# EAGLE board E-P-206-R2.0.1 Fuel Cell Control (EAGLE 7.7.0)
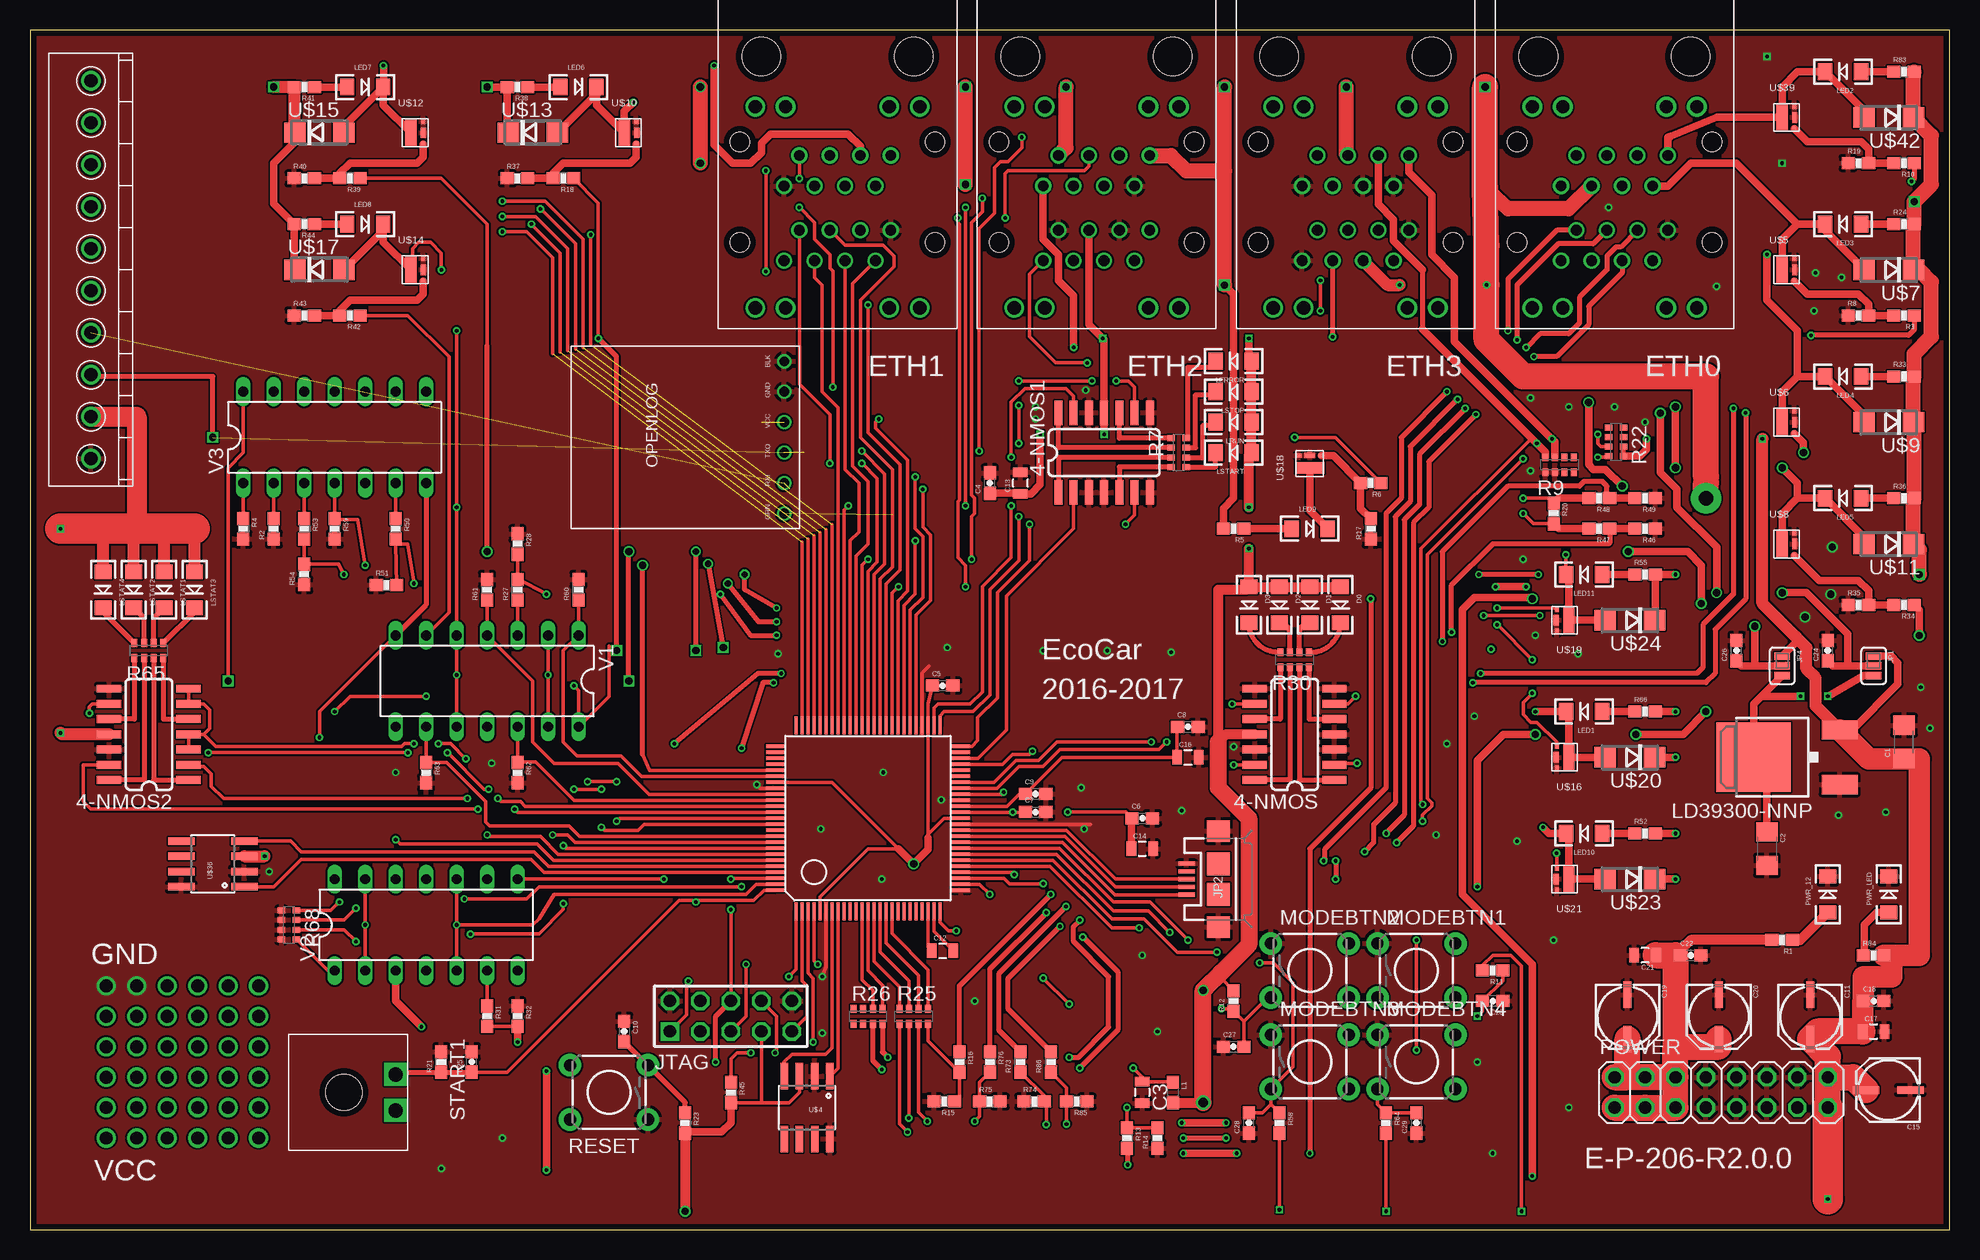
[diagram p5: board, top side]
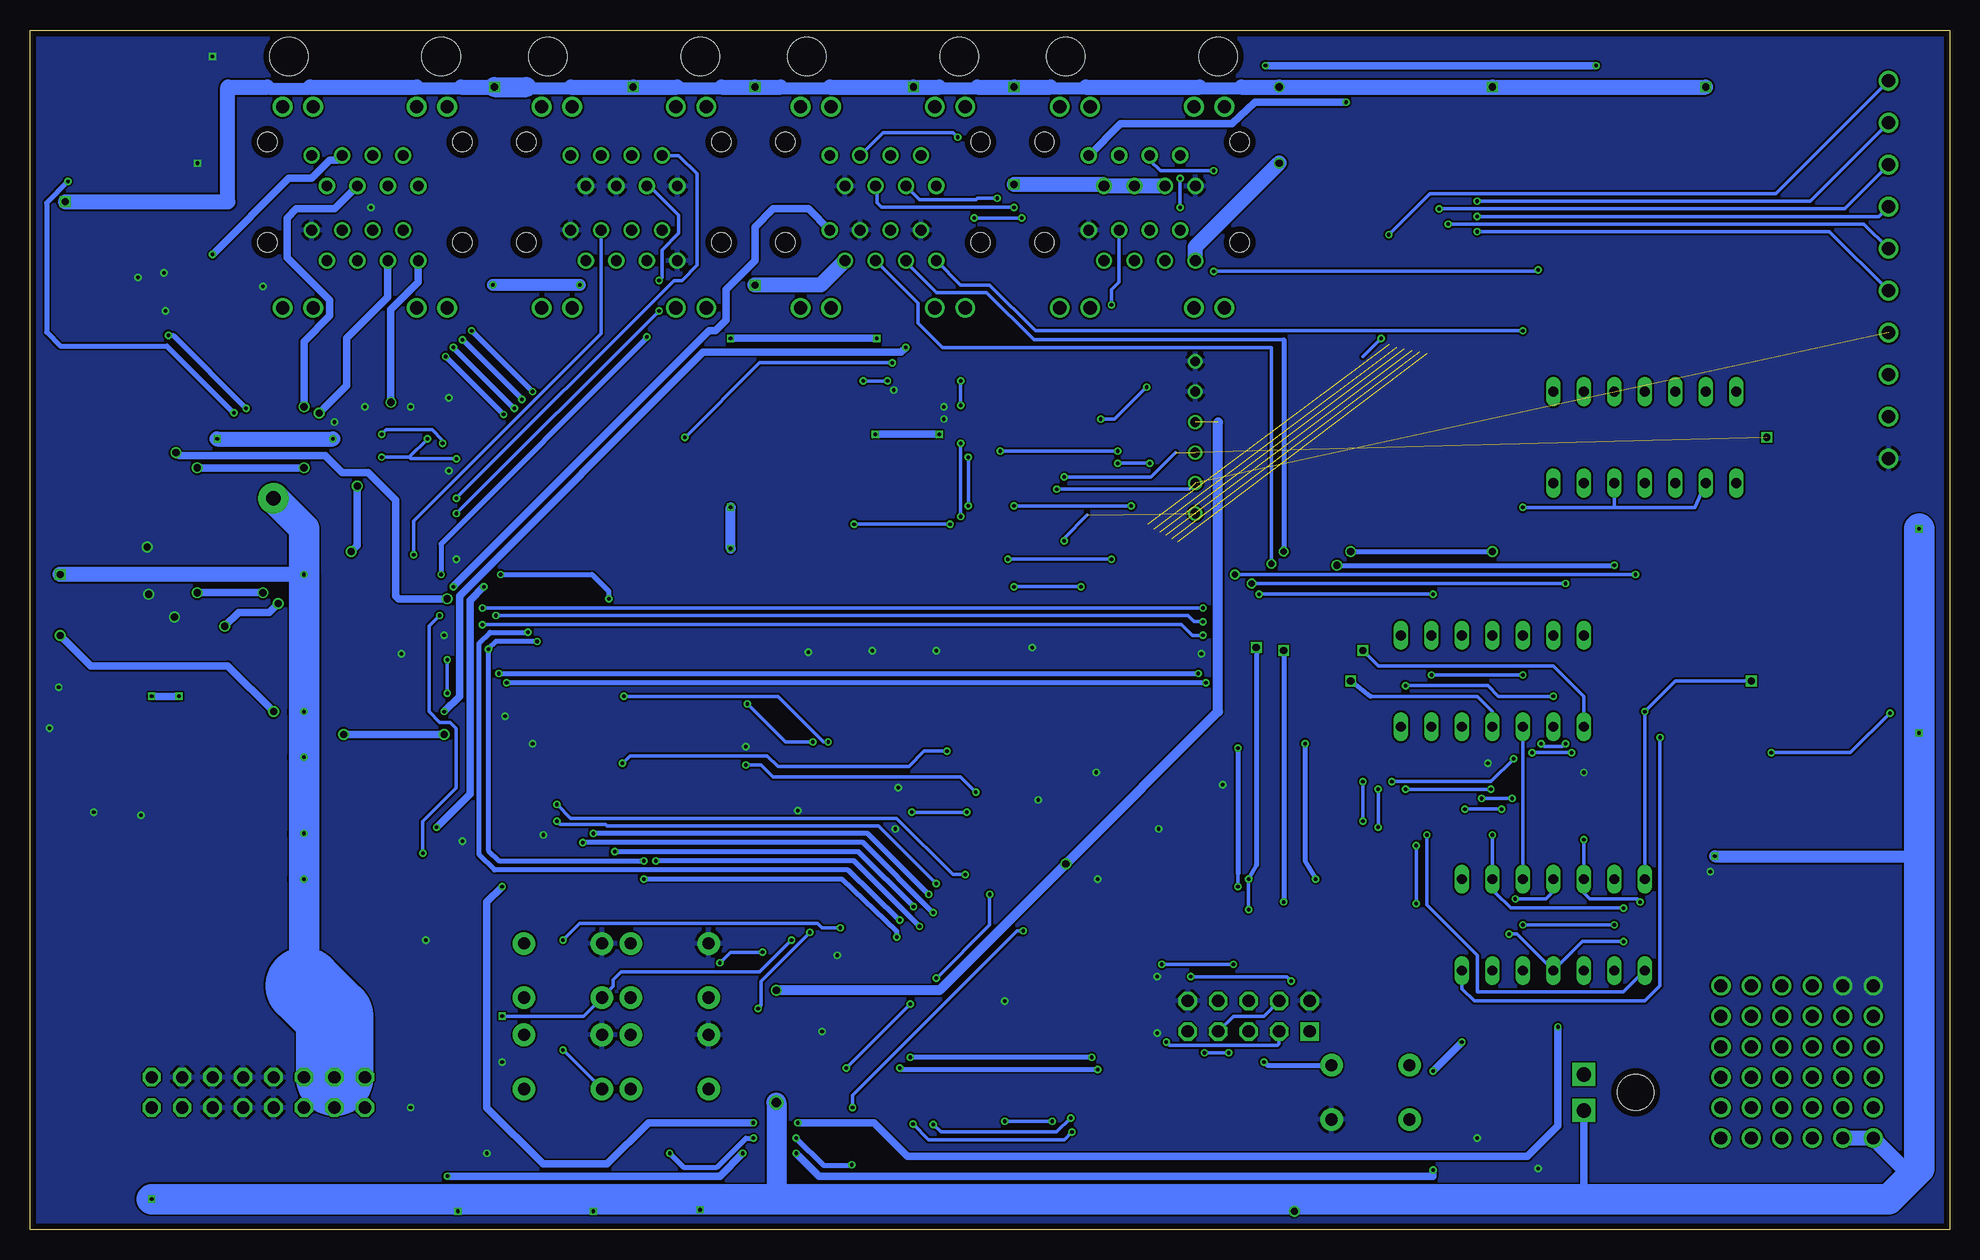
[diagram p6: board, bottom side, seen from below]

Size 160 x 100 mm. Coordinates in mm from the lower left corner, seen from the top.
Outline: 0,0 160,0 160,100 0,100 0,0
Copper layers (1*16): Top 0.035mm / dielectric 1.6mm / Bottom 0.035mm
Design rules "Elecrow_2-layer_PCB_eagle_rule": minimum track width 6mil, minimum drill 12mil, track to track 6mil, track to pad 6mil, pad to pad 6mil, via to via 8mil, smd to smd 0mil, copper to edge 20mil, drill to drill 10mil, minimum pad ring 6mil, minimum via ring 6mil, stop-mask expansion 0mil, vias tented up to drill 100mil, thermal gap 10mil

## Footprints (pad centres in the part's own frame; a part is rotated, then mirrored left to right if it is on the bottom)
SOIC-14 = smd 0.66 x 2.032: 1 -4.445,-3.315; 2 -3.175,-3.315; 3 -1.905,-3.315; 4 -0.635,-3.315; 5 0.635,-3.315; 6 1.905,-3.315; 7 3.175,-3.315; 8 3.175,3.315; 9 1.905,3.315; 10 0.635,3.315; 11 -0.635,3.315; 12 -1.905,3.315; 13 -3.175,3.315; 14 -4.445,3.315
1206 = smd 1.6 x 1.8: 1 -1.4,0; 2 1.4,0
0805 = smd 0.8 x 1.2: 1 -0.9,0; 2 0.9,0
0603-CAP = smd 1.1 x 1: 1 -0.85,0; 2 0.85,0
PANASONIC_C = smd 2.2 x 0.65: + 1.9,-0.2; - -1.8,-0.2
LED-1206 = smd 1.2 x 1.4: A -1.5,0; C 1.5,0
SJ_3_PASTE1&2 = smd 0.635 x 1.27: 1 -0.813,0; 2 0,0; 3 0.813,0
USB-MICROB = smd 0.35 x 1.4: D+ 0,2.65; D- -0.65,2.65; GND 1.3,2.65; ID 0.65,2.65; VBUS -1.3,2.65 | smd 1.8 x 1.9: MT1 -4,0; MT2 4,0 | smd 1.9 x 1.9: P$1 -1.27,0; P$2 1.27,0
AVR-JTAG-10 = drill 1.016 square: 1 -5.08,-1.27 | drill 1.016 octagon: 2 -5.08,1.27; 3 -2.54,-1.27; 4 -2.54,1.27; 5 0,-1.27; 6 0,1.27; 7 2.54,-1.27; 8 2.54,1.27; 9 5.08,-1.27; 10 5.08,1.27
0603 = smd 1.1 x 1: 1 -0.85,0; 2 0.85,0
DPACK = smd 1.6 x 3: 1 -2.28,-4.8; 3 2.28,-4.8 | smd 5.8 x 6.2: 4 0,2.38
TQFP100 = smd 0.27 x 1.5: 1 -6,-7.75; 2 -5.5,-7.75; 3 -5,-7.75; 4 -4.5,-7.75; 5 -4,-7.75; 6 -3.5,-7.75; 7 -3,-7.75; 8 -2.5,-7.75; 9 -2,-7.75; 10 -1.5,-7.75; 11 -1,-7.75; 12 -0.5,-7.75; 13 0,-7.75; 14 0.5,-7.75; 15 1,-7.75; 16 1.5,-7.75; 17 2,-7.75; 18 2.5,-7.75; 19 3,-7.75; 20 3.5,-7.75; 21 4,-7.75; 22 4.5,-7.75; 23 5,-7.75; 24 5.5,-7.75; 25 6,-7.75; 51 6,7.75; 52 5.5,7.75; 53 5,7.75; 54 4.5,7.75; 55 4,7.75; 56 3.5,7.75; 57 3,7.75; 58 2.5,7.75; 59 2,7.75; 60 1.5,7.75; 61 1,7.75; 62 0.5,7.75; 63 0,7.75; 64 -0.5,7.75; 65 -1,7.75; 66 -1.5,7.75; 67 -2,7.75; 68 -2.5,7.75; 69 -3,7.75; 70 -3.5,7.75; 71 -4,7.75; 72 -4.5,7.75; 73 -5,7.75; 74 -5.5,7.75; 75 -6,7.75 | smd 1.5 x 0.27: 26 7.75,-6; 27 7.75,-5.5; 28 7.75,-5; 29 7.75,-4.5; 30 7.75,-4; 31 7.75,-3.5; 32 7.75,-3; 33 7.75,-2.5; 34 7.75,-2; 35 7.75,-1.5; 36 7.75,-1; 37 7.75,-0.5; 38 7.75,0; 39 7.75,0.5; 40 7.75,1; 41 7.75,1.5; 42 7.75,2; 43 7.75,2.5; 44 7.75,3; 45 7.75,3.5; 46 7.75,4; 47 7.75,4.5; 48 7.75,5; 49 7.75,5.5; 50 7.75,6; 76 -7.75,6; 77 -7.75,5.5; 78 -7.75,5; 79 -7.75,4.5; 80 -7.75,4; 81 -7.75,3.5; 82 -7.75,3; 83 -7.75,2.5; 84 -7.75,2; 85 -7.75,1.5; 86 -7.75,1; 87 -7.75,0.5; 88 -7.75,0; 89 -7.75,-0.5; 90 -7.75,-1; 91 -7.75,-1.5; 92 -7.75,-2; 93 -7.75,-2.5; 94 -7.75,-3; 95 -7.75,-3.5; 96 -7.75,-4; 97 -7.75,-4.5; 98 -7.75,-5; 99 -7.75,-5.5; 100 -7.75,-6
TACTILE-PTH = drill 1.016 pad 1.88: 1 -3.251,2.261; 2 3.251,2.261; 3 -3.251,-2.261; 4 3.251,-2.261
2X08 = drill 1.016 octagon: 1 -8.89,-1.27; 2 -8.89,1.27; 3 -6.35,-1.27; 4 -6.35,1.27; 5 -3.81,-1.27; 6 -3.81,1.27; 7 -1.27,-1.27; 8 -1.27,1.27; 9 1.27,-1.27; 10 1.27,1.27; 11 3.81,-1.27; 12 3.81,1.27; 13 6.35,-1.27; 14 6.35,1.27; 15 8.89,-1.27; 16 8.89,1.27
0603-RES = smd 1.1 x 1: 1 -0.85,0; 2 0.85,0
0603-ARV = smd 0.5 x 0.65: 1 -1.2,-0.625; 2 -0.4,-0.625; 3 0.4,-0.625; 4 1.2,-0.625; 5 1.2,0.625; 6 0.4,0.625; 7 -0.4,0.625; 8 -1.2,0.625
2XETHERNET = drill 0.9: B_1 -4.44,8.25; B_2 -3.17,10.79; B_3 -1.9,8.25; B_4 -0.63,10.79; B_5 0.64,8.25; B_6 1.91,10.79; B_7 3.18,8.25; B_8 4.45,10.79; T_1 4.45,17.02; T_2 3.18,14.48; T_3 1.91,17.02; T_4 0.64,14.48; T_5 -0.63,17.02; T_6 -1.9,14.48; T_7 -3.17,17.02; T_8 -4.44,14.48 | drill 1.1: B_9 -6.86,4.19; B_10 -4.32,4.19; B_11 4.32,4.19; B_12 6.86,4.19; T_9 -6.86,20.95; T_10 -4.32,20.95; T_11 4.32,20.95; T_12 6.86,20.95 | hole 3.2: -6.35,0; 6.35,0 | hole 1.6: -8.13,15.49; 8.13,15.49; -8.13,7.11; 8.13,7.11
10X1PCBBLOCK = drill 1.1: 1 -15.75,0; 2 -12.25,0; 3 -8.75,0; 4 -5.25,0; 5 -1.75,0; 6 1.75,0; 7 5.25,0; 8 8.75,0; 9 12.25,0; 10 15.75,0
43650-0200 = drill 1.2 pad 1.93 square: P$1 -1.5,0; P$2 1.5,0 | hole 3: 0,-4.32
OPENLOG = drill 0.8: P$1 -6.35,-8.255; P$2 -3.81,-8.255; P$3 -1.27,-8.255; P$4 1.27,-8.255; P$5 3.81,-8.255; P$6 6.35,-8.255
8-SOIC = smd 0.61 x 2.21: 1 0.635,-0.076; 2 1.905,-0.076; 3 3.175,-0.076; 4 4.445,-0.076; 5 4.445,5.156; 6 3.175,5.156; 7 1.905,5.156; 8 0.635,5.156
SC70-6L = smd 0.95 x 2.4: D 0,0 | smd 0.35 x 0.5: G 1.01,-0.95; S@0 1.01,0.95 | smd 0.45 x 0.87: S@1 1.05,0
DO214AC = smd 1.8 x 1.7: A 2.05,0; C -2.05,0
DIL14 = drill 0.813 long: 1 -7.62,-3.81; 2 -5.08,-3.81; 3 -2.54,-3.81; 4 0,-3.81; 5 2.54,-3.81; 6 5.08,-3.81; 7 7.62,-3.81; 8 7.62,3.81; 9 5.08,3.81; 10 2.54,3.81; 11 0,3.81; 12 -2.54,3.81; 13 -5.08,3.81; 14 -7.62,3.81

## Placement (x,y rotation side)
4-NMOS  ALD1106PBL  [SOIC-14]  105.41,41.91 90 top
4-NMOS1  ALD1106PBL  [SOIC-14]  90.17,64.77 0 top
4-NMOS2  ALD1106PBL  [SOIC-14]  9.91,41.91 90 top
C1  NNP  [1206]  156.21,40.64 90 top
C2  NNP  [1206]  144.78,31.75 270 top
C3  100uF  [0805]  92.71,11.43 270 top
C4  100nF  [0603-CAP]  80.01,62.23 90 top
C5  1nF  [0603-CAP]  76.07,45.34 0 top
C6  100nF  [0603-CAP]  92.71,34.29 0 top
C7  470pF  [0603-CAP]  83.82,34.8 0 top
C8  100nF  [0603-CAP]  96.52,41.91 0 top
C9  470pF  [0603-CAP]  83.82,36.32 0 top
C10  22nF  [0603-CAP]  49.53,16.51 270 top
C11  100uF  [PANASONIC_C]  148.59,17.78 270 top
C12  100nF  [0805]  76.07,23.24 0 top
C13  4.7uF  [0805]  82.55,62.23 90 top
C14  4.7uF  [0805]  92.71,31.75 0 top
C15  100uF  [PANASONIC_C]  154.94,11.43 180 top
C16  2.2uF  [0805]  96.52,39.37 0 top
C17  1uF  [0805]  153.67,16.51 0 top
C18  10nF  [0603-CAP]  153.67,19.05 0 top
C19  100uF  [PANASONIC_C]  133.35,17.78 270 top
C20  100uF  [PANASONIC_C]  140.97,17.78 270 top
C21  1uF  [0805]  134.62,22.86 180 top
C22  10nF  [0603-CAP]  138.43,22.86 0 top
C23  22nF  [0603-CAP]  121.92,19.05 180 top
C24  100nF  [0603-CAP]  149.86,48.26 90 top
C25  100nF  [0603-CAP]  36.83,13.97 90 top
C26  100nF  [0603-CAP]  142.24,48.26 90 top
C27  22nF  [0603-CAP]  100.33,15.24 0 top
C28  22nF  [0603-CAP]  101.6,8.89 90 top
C29  22nF  [0603-CAP]  115.57,8.89 90 top
D0  [LED-1206]  109.22,52.07 270 top
D1  [LED-1206]  106.68,52.07 270 top
D2  [LED-1206]  104.14,52.07 270 top
D3  [LED-1206]  101.6,52.07 270 top
JP1  JUMPER-31-2  [SJ_3_PASTE1&2]  153.67,46.99 270 top
JP2  USB  [USB-MICROB]  99.06,29.21 90 top
JP4  JUMPER-31-2  [SJ_3_PASTE1&2]  146.05,46.99 270 top
JTAG  2x5  [AVR-JTAG-10]  58.42,17.78 0 top
L1  BLM18KG221SN1D  [0603]  95.25,11.43 270 top
LD39300-NNP  LD117ADT50TR  [DPACK]  146.05,39.37 90 top
LED1  [LED-1206]  129.54,43.18 180 top
LED2  [LED-1206]  151.13,96.52 180 top
LED3  [LED-1206]  151.13,83.82 180 top
LED4  [LED-1206]  151.13,71.12 180 top
LED5  [LED-1206]  151.13,60.96 180 top
LED6  [LED-1206]  45.72,95.25 0 top
LED7  [LED-1206]  27.94,95.25 0 top
LED8  [LED-1206]  27.94,83.82 0 top
LED9  [LED-1206]  106.68,58.42 0 top
LED10  [LED-1206]  129.54,33.02 180 top
LED11  [LED-1206]  129.54,54.61 180 top
LERROR  RED  [LED-1206]  100.33,72.39 180 top
LRUN  GREEN  [LED-1206]  100.33,67.31 180 top
LSTART  BLUE  [LED-1206]  100.33,64.77 180 top
LSTAT1  GREEN  [LED-1206]  11.18,53.34 270 top
LSTAT2  YELLOW  [LED-1206]  8.64,53.34 270 top
LSTAT3  BLUE  [LED-1206]  13.72,53.34 270 top
LSTAT4  RED  [LED-1206]  6.1,53.34 270 top
LSTOP  YELLOW  [LED-1206]  100.33,69.85 180 top
MCU  AT32UC3C1512  [TQFP100]  69.85,34.29 0 top
MODEBTN1  SWITCH-MOMENTARY-2PTH  [TACTILE-PTH]  115.57,21.59 0 top
MODEBTN2  SWITCH-MOMENTARY-2PTH  [TACTILE-PTH]  106.68,21.59 0 top
MODEBTN3  SWITCH-MOMENTARY-2PTH  [TACTILE-PTH]  106.68,13.97 0 top
MODEBTN4  SWITCH-MOMENTARY-2PTH  [TACTILE-PTH]  115.57,13.97 0 top
POWER  [2X08]  140.97,11.43 0 top
PWR_12  GREEN  [LED-1206]  149.86,27.94 90 top
PWR_LED  [LED-1206]  154.94,27.94 90 top
R1  1k  [0603-RES]  146.05,24.13 180 top
R2  10k\  [0603-RES]  20.32,58.42 90 top
R3  1k  [0603-RES]  156.21,76.2 180 top
R4  10k  [0603-RES]  17.78,58.42 270 top
R5  1k  [0603-RES]  100.33,58.42 180 top
R6  1k  [0603-RES]  111.76,62.23 180 top
R7  470  [0603-ARV]  95.76,64.77 270 top
R8  10k  [0603-RES]  152.4,76.2 0 top
R9  100k  [0603-ARV]  127.51,63.75 0 top
R10  1k  [0603-RES]  156.21,88.9 180 top
R11  10k  [0603-RES]  121.92,21.59 180 top
R12  10k  [0603-RES]  100.33,19.05 90 top
R13  31.6k 1%  [0603-RES]  91.44,7.62 270 top
R14  47k 1%  [0603-RES]  93.98,7.62 90 top
R15  3k 1%  [0603-RES]  76.2,10.67 180 top
R16  47k 1%  [0603-RES]  77.47,13.97 270 top
R17  10k  [0603-RES]  111.76,58.42 90 top
R18  1k  [0603-RES]  44.45,87.63 180 top
R19  10k  [0603-RES]  152.4,88.9 0 top
R20  10k  [0603-RES]  127,59.69 270 top
R21  4.7k  [0603-RES]  34.29,13.97 90 top
R22  100k  [0603-ARV]  132.21,65.66 90 top
R23  10k  [0603-RES]  54.61,8.89 270 top
R24  1k  [0603-RES]  156.21,83.82 0 top
R25  10k  [0603-ARV]  73.66,17.78 180 top
R26  10k  [0603-ARV]  69.85,17.78 180 top
R27  1k  [0603-RES]  40.64,53.34 90 top
R28  10k  [0603-RES]  40.64,57.15 270 top
R30  470  [0603-ARV]  105.41,47.5 0 top
R31  1k  [0603-RES]  38.1,17.78 270 top
R32  10k  [0603-RES]  40.64,17.78 270 top
R33  1k  [0603-RES]  156.21,71.12 0 top
R34  1k  [0603-RES]  156.21,52.07 180 top
R35  10k  [0603-RES]  152.4,52.07 0 top
R36  1k  [0603-RES]  156.21,60.96 0 top
R37  10k  [0603-RES]  40.64,87.63 0 top
R38  1k  [0603-RES]  40.64,95.25 180 top
R39  1k  [0603-RES]  26.67,87.63 180 top
R40  10k  [0603-RES]  22.86,87.63 0 top
R41  1k  [0603-RES]  22.86,95.25 180 top
R42  1k  [0603-RES]  26.67,76.2 180 top
R43  10k  [0603-RES]  22.86,76.2 0 top
R44  1k  [0603-RES]  22.86,83.82 180 top
R45  10k  [0603-RES]  58.42,11.43 270 top
R46  47k 1%  [0603-RES]  134.62,58.42 180 top
R47  31.6k 1%  [0603-RES]  130.81,58.42 180 top
R48  31.6k 1%  [0603-RES]  130.81,60.96 180 top
R49  47k 1%  [0603-RES]  134.62,60.96 180 top
R50  1k  [0603-RES]  30.48,58.42 270 top
R51  10k  [0603-RES]  29.72,53.72 0 top
R52  1k  [0603-RES]  134.62,33.02 0 top
R53  1k  [0603-RES]  22.86,58.42 270 top
R54  10k  [0603-RES]  22.86,54.61 90 top
R55  1k  [0603-RES]  134.62,54.61 0 top
R58  10k  [0603-RES]  104.14,8.89 270 top
R59  10k  [0603-RES]  25.4,58.42 270 top
R60  10k  [0603-RES]  45.72,53.34 90 top
R61  10k  [0603-RES]  38.1,53.34 90 top
R62  10k  [0603-RES]  40.64,38.1 270 top
R63  10k  [0603-RES]  33.02,38.1 270 top
R64  10k  [0603-RES]  113.03,8.89 270 top
R65  470  [0603-ARV]  9.91,48.26 0 top
R66  1k  [0603-RES]  134.62,43.18 0 top
R68  10k  [0603-ARV]  21.59,25.4 90 top
R73  31.6k 1%  [0603-RES]  82.55,13.97 90 top
R74  47k 1%  [0603-RES]  83.69,10.67 0 top
R75  3k 1%  [0603-RES]  80.01,10.67 0 top
R76  47k 1%  [0603-RES]  80.01,13.97 270 top
R83  1k  [0603-RES]  156.21,96.52 0 top
R84  100  [0603-RES]  153.67,22.86 0 top
R85  47k 1%  [0603-RES]  87.25,10.67 180 top
R86  31.6k 1%  [0603-RES]  85.09,13.97 90 top
RESET  SWITCH-MOMENTARY-2PTH  [TACTILE-PTH]  48.26,11.43 180 top
RJ45_0_  2XETHERNET  [2XETHERNET]  132.08,97.79 180 top
RJ45_1_  2XETHERNET  [2XETHERNET]  67.31,97.79 180 top
RJ45_2_  2XETHERNET  [2XETHERNET]  88.9,97.79 180 top
RJ45_3_  2XETHERNET  [2XETHERNET]  110.49,97.79 180 top
SCREWTERMINAL  10X1PCBBLOCK  [10X1PCBBLOCK]  5.08,80.01 270 top
START1  43650-0200  [43650-0200]  30.48,11.43 270 top
U$1  OPENLOG  [OPENLOG]  54.61,66.04 90 top
U$4  MCP2551  [8-SOIC]  67.31,12.7 180 top
U$5  SIA448DJ-T1  [SC70-6L]  146.05,80.01 0 top
U$6  SIA448DJ-T1  [SC70-6L]  146.05,67.31 0 top
U$7  [DO214AC]  154.94,80.01 180 top
U$8  SIA448DJ-T1  [SC70-6L]  146.05,57.15 0 top
U$9  [DO214AC]  154.94,67.31 180 top
U$10  SIA448DJ-T1  [SC70-6L]  49.53,91.44 0 top
U$11  [DO214AC]  154.94,57.15 180 top
U$12  SIA448DJ-T1  [SC70-6L]  31.75,91.44 0 top
U$13  [DO214AC]  41.91,91.44 0 top
U$14  SIA448DJ-T1  [SC70-6L]  31.75,80.01 0 top
U$15  [DO214AC]  24.13,91.44 0 top
U$16  SIA448DJ-T1  [SC70-6L]  128.27,39.37 180 top
U$17  [DO214AC]  24.13,80.01 0 top
U$18  SIA448DJ-T1  [SC70-6L]  106.68,63.5 90 top
U$19  SIA448DJ-T1  [SC70-6L]  128.27,50.8 180 top
U$20  [DO214AC]  133.35,39.37 180 top
U$21  SIA448DJ-T1  [SC70-6L]  128.27,29.21 180 top
U$23  [DO214AC]  133.35,29.21 180 top
U$24  [DO214AC]  133.35,50.8 180 top
U$36  MCP2551  [8-SOIC]  17.78,27.94 90 top
U$39  SIA448DJ-T1  [SC70-6L]  146.05,92.71 0 top
U$42  [DO214AC]  154.94,92.71 180 top
V1  SN74HC08N  [DIL14]  38.1,45.72 180 top
V2  SN74HC08N  [DIL14]  33.02,25.4 0 top
V3  SN74HC08N  [DIL14]  25.4,66.04 0 top

## Tracks (layer width: path | path; a pad name or v marks a point on that pad's centre or on a via)
3V  (via drill 0.3)
  Top 0.61: 144.32,44.45 JP4.3 | JP1.3 152.86,46.18 v149.86,44.45 | v147.57,44.45 144.32,44.45 | 144.32,44.45 143.67,43.8 LD39300-NNP.4 144.78,38.26 C2.1
  Bottom 0.61: v149.86,44.45 v147.57,44.45
+12V  (via drill 0.3, 0.6, 1.2 pad 2.54)
  Top 0.305: 137.16,22.86 C22.1
  Top 0.61: R5.2 99.48,60.11 100.33,60.96 100.33,77.98 v99.57,78.74 | v38.1,95.25 R38.2 39.79,91.51 U$13.C | 22.01,91.51 U$15.C 22.08,90.66 20.32,88.9 20.32,85.51 R44.2 22.01,80.08 U$17.C | U$23.C v137.16,29.21 | 135.4,32.95 R52.2 v137.16,33.02 | U$20.C v137.16,39.37 | 135.4,43.11 R66.2 v137.16,43.18 | U$24.C 135.47,50.87 R55.2 v137.16,54.61
  Top 0.813: R1.2 138.43,24.13 137.16,22.86
  Top 1.016: v20.32,95.25 R41.2 22.01,91.51 | RJ45_3_.T_5 113.15,78.74 v114.17,78.74
  Top 1.27: 135.47,50.73 U$24.C | v157.48,54.61 157.48,56.66 U$11.C 156.99,60.89 R36.2 157.06,67.24 U$9.C 156.99,71.05 R33.2 157.06,72.99 158.5,74.42 158.5,78.99 157.48,80.01 U$7.C 156.99,83.75 R24.2 v157.06,85.69 158.5,87.12 158.5,91.2 U$42.C 156.99,96.45 R83.2 | RJ45_0_.B_6 128.26,85.09 123.19,85.09 121.28,86.87 | RJ45_3_.B_5 109.73,89.66 v109.73,95.25 | v99.57,78.74 99.57,88.27 | 99.57,88.27 v99.57,95.25 | RJ45_2_.B_7 86.36,90.18 v86.36,95.25 | v77.98,87.12 v77.98,95.25 | RJ45_2_.B_1 95.12,89.54 96.39,88.27 99.57,88.27 | v55.88,88.9 v55.88,95.25
  Top 2.184: POWER.1 POWER.3 POWER.5 POWER.6 | POWER.6 POWER.4 POWER.2 133.15,12.7 C19.+ | POWER.6 137.16,15.24 | 137.16,15.24 140.77,15.24 C20.+ | C21.1 137.16,22.86 137.16,15.24 | v121.28,95.25 121.28,86.87 121.41,82.04 v121.41,78.74 121.41,74.17 124.46,71.12 139.7,71.12 139.7,62.74 | v139.7,60.96 139.7,62.23
  Bottom 1.016: v114.17,78.74 v121.41,78.74 | 59.05,95.25 59.18,95.12 62.36,95.12 62.48,95.25 | 72.01,95.25 72.14,95.12 74.8,95.12 74.93,95.25 | 81.03,95.25 81.15,95.12 84.07,95.12 84.2,95.25 | 93.34,95.25 93.47,95.12 97.28,95.12 97.41,95.25 | 102.36,95.25 102.49,95.12 105.92,95.12 106.05,95.25 | 114.94,95.25 115.06,95.12 118.49,95.12 118.62,95.25 | 124.08,95.25 124.21,95.12 127.64,95.12 127.76,95.25 | 140.21,95.25 140.08,95.12 136.78,95.12 136.65,95.25
  Bottom 1.27: v137.16,54.61 v157.48,54.61 | v157.06,85.69 143.51,85.69 143.51,95.25 140.21,95.25 | 136.65,95.25 127.76,95.25 | 124.08,95.25 v121.28,95.25 | 114.94,95.25 v109.73,95.25 106.05,95.25 | 102.36,95.25 v99.57,95.25 97.41,95.25 | 93.34,95.25 v86.36,95.25 84.2,95.25 | 81.03,95.25 v77.98,95.25 74.93,95.25 | 72.01,95.25 62.48,95.25 | 59.05,95.25 v55.88,95.25 v38.1,95.25 v20.32,95.25 | RJ45_2_.T_7 94.1,78.74 v99.57,78.74 | RJ45_1_.B_6 RJ45_1_.B_4 RJ45_1_.B_2 70.6,87.12 v77.98,87.12 | RJ45_1_.T_1 62.86,81.92 v55.88,88.9
  Bottom 1.676: v121.28,95.25 118.62,95.25
  Bottom 2.54: 137.16,20.32 v137.16,29.21 v137.16,33.02 v137.16,39.37 v137.16,43.18 v137.16,54.61 137.16,58.42 v139.7,60.96
  Bottom 6.452: 137.16,20.32 134.62,17.78 POWER.4
+UB  (via drill 0.3, 0.6)
  Top 0.305: 48.26,48.64 48.26,44.45 V1.14 45.72,44.96 v45.34,45.34 | v25.4,43.18 26.67,44.45 v33.02,44.45 | V3.14 17.78,64.77 16.51,63.5 v16.51,45.72
  Bottom 0.305: V2.14 v25.4,43.18 22.86,45.72 v16.51,45.72 | v33.02,44.45 37.59,44.45 38.48,45.34 v45.34,45.34
-UB  (via drill 0.3)
  Top 0.305: V1.7 24.13,43.18 v24.13,41.02
  Top 0.406: V3.7 33.02,52.07 V1.7
  Bottom 0.305: v24.13,41.02 24.13,20.32 25.4,19.05 39.62,19.05 40.64,20.07 V2.7
ANA_DECOUP  (via drill 0.3)
  Top 0.305: L1.1 95.25,12.33 C3.1 92.71,12.7 v91.95,13.46 | MCU.27 79.16,28.79 v80.01,27.94 | v84.45,20.95 v86.61,18.8
  Bottom 0.305: v80.01,27.94 80.01,25.4 v84.45,20.95 | v86.61,18.8 v91.95,13.46
CAN-EXP_RX
  Top 0.305: MCU.96 43.24,30.29 42.04,31.5 22.61,31.5 21.72,32.38 U$36.4
CAN-EXP_TX
  Top 0.305: MCU.97 42.85,29.79 41.78,30.86 22.61,30.86 20.32,28.57 U$36.1
CAN_RX
  Top 0.305: MCU.7 66.85,15.16 66.29,14.61 63.5,14.61 62.87,13.97 U$4.4
CAN_TX
  Top 0.305: MCU.8 67.35,13.45 U$4.1
CAPCURR  (via drill 0.3)
  Top 0.406: RJ45_0_.T_2 127.25,83.31 123.19,79.25 v123.19,74.93 | v118.11,69.85 114.3,66.04 114.3,60.96 113.03,59.69 113.03,36.83 107.95,31.75 107.95,30.86 v107.82,30.73 | R86.2 81.53,18.38 81.53,20.95 v85.85,25.27
  Bottom 0.406: v123.19,74.93 v118.11,69.85 | v85.85,25.27 91.31,30.73 v107.82,30.73
CAPCURR(S)  (via drill 0.3)
  Top 0.305: R86.1 86.4,11.81 R85.2 v86.4,8.8 | R25.5 72.46,8.82 v73.15,8.13
  Bottom 0.305: v73.15,8.13 73.79,7.49 85.09,7.49 v86.4,8.8
CAPCURR_V_R  (via drill 0.6)
  Top 0.61: 143.76,46.99 JP4.2 | C26.1 142.66,46.99 143.76,46.99 | 143.76,46.99 v143.76,50.29 | v139.32,52.2 139.32,55.37 138.18,56.52 v133.22,56.52 | v132.72,61.98 131.32,63.37 130.3,63.37 129.92,63.75 v129.92,68.96
  Bottom 0.61: v143.76,50.29 142.62,51.44 140.08,51.44 v139.32,52.2 | v133.22,56.52 132.72,57.02 v132.72,61.98 | v129.92,68.96 129.92,76.71 127.63,79 RJ45_0_.T_1
CAPREL_R  (via drill 0.3)
  Top 0.61: 147.32,71.12 LED4.C 152.89,67.86 U$9.A | 147.32,71.12 146.05,69.85 U$6.D | 147.32,71.12 147.32,74.93 144.78,77.47 v144.78,81.28
  Bottom 0.61: v144.78,81.28 138.43,87.63 136.53,87.63 135,89.15 134.37,89.15 RJ45_0_.B_3
CAPVOLT  (via drill 0.3)
  Top 0.305: R76.2 79.16,12.27 R75.1 79.16,9.44 v78.74,9.02 | R25.7 74.06,9.76 v74.8,9.02
  Bottom 0.305: v74.8,9.02 v78.74,9.02
CAPVOLT_R  (via drill 0.3)
  Top 0.406: RJ45_0_.T_5 132.72,79.76 129.92,76.96 129.92,75.44 127.25,72.77 v125.35,72.77 | v120.52,67.94 116.59,64.01 116.59,60.2 115.32,58.93 115.32,33.66 v113.92,32.26 | R76.1 80.01,21.72 v84.71,26.42
  Bottom 0.406: v125.35,72.77 v120.52,67.94 | v84.71,26.42 90.55,32.26 v113.92,32.26
CVMPURGE_V_R  (via drill 0.3)
  Top 0.305: MCU.58 72.35,52.41 73.15,53.21 73.15,64.14 70.48,66.8 70.48,67.31 v70.74,67.56 | v64.14,85.22 65.41,83.95 65.41,82.55 66.67,81.28 66.67,80.14 66.93,79.88 v66.93,70.23 | v64.14,87.63 RJ45_1_.B_7
  Bottom 0.305: v70.74,67.56 69.6,67.56 v66.93,70.23 | v64.14,85.22 v64.14,87.63
FAN1_PWM_R  (via drill 0.3)
  Top 0.305: MCU.63 69.85,54.86 70.61,55.63 70.61,62.61 v69.34,63.88 | v66.67,63.88 66.67,67.94 64.13,70.49 RJ45_1_.T_2
  Bottom 0.305: v69.34,63.88 v66.67,63.88
FAN1_TACH_R
  Top 0.305: MCU.68 67.35,68.54 66.04,69.85 66.04,78.74 65.41,79.38 RJ45_1_.T_3
FAN2_PWM_R  (via drill 0.3)
  Top 0.305: MCU.62 70.35,54.6 71.25,55.5 71.25,62.99 v69.34,64.9 | v79.12,64.9 79.12,83.44 80.39,84.71 80.39,88.52 80.9,89.03 81.53,89.03 82.68,90.17 v82.68,91.06
  Bottom 0.305: v69.34,64.9 v79.12,64.9 | v82.68,91.06 83.06,91.44 88.9,91.44 RJ45_2_.B_3
FAN2_TACH_R  (via drill 0.3)
  Top 0.305: MCU.67 67.85,59.98 v68.2,60.33 | v77.98,60.33 v77.98,85.22
  Bottom 0.305: v68.2,60.33 v77.98,60.33 | v77.98,85.22 89.03,85.22 89.41,85.6 89.41,86.88 RJ45_2_.B_4
FAN3_PWM_R
  Top 0.305: MCU.61 70.85,54.21 71.88,55.24 71.88,63.37 69.22,66.04 69.22,77.47 72.01,80.26 72.01,81.15 71.12,82.04 67.94,82.04 RJ45_1_.T_4
FAN3_TACH_R
  Top 0.305: MCU.66 68.35,57.43 69.09,58.17 69.09,62.23 67.94,63.37 RJ45_1_.T_5
FAN4_PWM_R  (via drill 0.3)
  Top 0.305: MCU.60 71.35,53.82 72.52,54.99 72.52,63.75 69.85,66.42 v69.85,77.09
  Bottom 0.305: v69.85,77.09 69.85,78.36 69.22,78.99 RJ45_1_.T_6
FAN4_TACH_R
  Top 0.305: MCU.65 68.85,56.15 69.85,57.15 69.85,62.36 68.58,63.63 68.58,78.87 RJ45_1_.T_7
FAN5_PWM_R  (via drill 0.3)
  Top 0.305: MCU.59 71.85,53.05 v72.39,53.59 | v81.28,84.33 81.28,88.01 81.53,88.27 87.88,88.27 88.26,88.64 RJ45_2_.B_5 | v77.98,53.59 77.98,55.37 77.34,56.01 77.34,60.71 77.47,60.83 77.47,83.82 77.34,83.95 v77.34,84.33
  Bottom 0.305: v72.39,53.59 v77.98,53.59 | v81.28,84.33 v77.34,84.33
FAN5_TACH_R  (via drill 0.3)
  Top 0.305: MCU.64 69.35,55.38 v69.85,55.88 | v78.49,55.88 78.49,59.44 78.74,59.69 78.74,60.96 78.49,61.21 78.49,83.95 79.38,84.84 v79.38,85.98
  Bottom 0.305: v69.85,55.88 v78.49,55.88 | RJ45_2_.B_6 85.84,85.85 81.15,85.85 81.03,85.98 v79.38,85.98
FCCURR  (via drill 0.3)
  Top 0.406: RJ45_0_.T_4 130.3,82.17 127.38,82.17 123.95,78.74 v123.95,74.17 | v119,69.22 115.06,65.28 115.06,60.71 113.79,59.44 113.79,35.56 112.01,33.78 112.01,32.26 v111.25,31.5 | R73.2 80.77,16.6 80.77,21.34 v86.36,26.92
  Bottom 0.406: v123.95,74.17 v119,69.22 | v86.36,26.92 90.93,31.5 v111.25,31.5
FCCURR(S)  (via drill 0.3)
  Top 0.305: R73.1 84.54,11.13 R74.2 84.71,10.5 v84.71,8.76 | R25.6 v73.26,9.29
  Bottom 0.305: v84.71,8.76 84.07,8.13 74.42,8.13 v73.26,9.29
FCCURR_V_R  (via drill 0.6)
  Top 0.61: 151.51,46.99 JP1.2 | C24.1 150.28,46.99 151.51,46.99 | 151.51,46.99 151.51,49.66 148.08,53.09 v146.05,53.09 | v140.59,53.09 140.59,56.9 137.29,60.2 137.29,61.72 135.89,63.12 v135.89,68.07
  Bottom 0.61: v146.05,53.09 v140.59,53.09 | v135.89,68.07 133.6,70.36 133.6,74.3 130.17,77.73 RJ45_0_.T_3
FCPRES_S0_R  (via drill 0.3)
  Top 0.305: 127.42,60.96 v124.46,60.96
  Top 0.61: R20.1 127.42,60.96 R48.2
  Bottom 0.305: v124.46,60.96 106.3,79.12 105.66,79.12 104.39,80.39 104.39,88.01 105.92,89.54 RJ45_3_.B_7
FCPRES_S1_R  (via drill 0.3)
  Top 0.305: R20.2 125.31,58.84 v124.46,59.69 | v107.57,76.58 v107.57,79.12
  Top 0.61: R20.2 127.42,58.42 R47.2
  Bottom 0.305: v124.46,59.69 v107.57,76.58 | v107.57,79.12 107.31,79.38 107.31,81.66 105.92,83.06 105.92,84.58 108.34,87 RJ45_3_.B_6
FCPRES_S+(S)  (via drill 0.3)
  Top 0.305: R47.1 131.7,58.38
  Top 0.406: 131.7,58.38 131.7,57.28 131.57,57.15 121.92,57.15 118.49,53.72 v118.49,49.78 | R26.8 71.05,14.8 v71.5,14.35 | v86.61,14.35 87.38,14.35 89.92,16.89 89.92,21.08 87,24 87,25.27 v87.5,25.78
  Top 0.61: R47.1 R46.2
  Bottom 0.406: v71.5,14.35 v86.61,14.35 | v87.5,25.78 91.82,29.97 121.28,29.97 122.56,31.24 122.56,48.9 121.67,49.78 v118.49,49.78
FCPRES_S-(S)  (via drill 0.3)
  Top 0.305: R48.1 131.44,61.17
  Top 0.406: 131.44,61.17 131.44,61.98 131.06,62.36 129.54,62.36 129.16,61.98 123.19,61.98 117.73,56.52 v117.73,49.02 | v108.84,30.73 v108.84,29.21 | v87.76,24.38 90.68,21.46 90.68,16.64 v87.5,13.46 | v70.99,13.34 70.25,14.08 R26.7
  Top 0.61: R48.1 R49.2
  Bottom 0.406: v117.73,49.02 121.16,49.02 v121.79,48.39 121.79,31.62 120.9,30.73 v108.84,30.73 | v108.84,29.21 92.33,29.21 87.76,24.89 v87.76,24.38 | v87.5,13.46 87.38,13.34 v70.99,13.34
FCTEMP1  (via drill 0.3)
  Top 0.305: R22.8 131.38,64.39 v130.68,64.39 | v124.46,64.26 116.46,56.26 116.46,35.94 116.84,35.56 116.84,35.31 116.08,34.54 v116.08,34.04 | v84.45,28.83 81.66,28.83 81.2,29.29 MCU.28
  Top 0.61: RJ45_3_.B_1 114.93,88.14 116.84,86.23 116.84,81.28 118.75,79.38 118.75,74.04 v126.87,65.91 127.11,65.68 R9.7
  Bottom 0.305: v130.68,64.39 128.4,64.39 | v126.87,65.91 128.4,64.39 | v124.46,64.26 128.27,64.26 128.4,64.39 | v116.08,34.04 115.82,33.78 112.01,33.78 111.89,33.66 89.28,33.66 v84.45,28.83
FCTEMP2  (via drill 0.3)
  Top 0.305: R22.7 130.96,65.26 130.68,65.53 v130.68,66.29 | 125.09,66.04 125.09,65.91 115.95,56.77 115.95,35.56 v116.08,35.43 | v82.04,29.59 81.84,29.79 MCU.29
  Top 0.406: 116.08,80.01 116.08,75.06
  Top 0.61: RJ45_3_.B_3 112.39,85.47 113.67,84.2 113.67,82.42 116.08,80.01 | 116.08,75.06 125.09,66.04 v125.6,65.53 126.31,64.83 R9.8
  Bottom 0.305: v125.6,65.53 125.6,65.79 126.49,66.67 130.3,66.67 v130.68,66.29 | v116.08,35.43 114.94,34.29 87.76,34.29 83.06,29.59 v82.04,29.59
FCVOLT
  Top 0.305: R25.8 74.86,15.73 R16.2 77.47,11.09 R15.1
FCVOLT_R  (via drill 0.3)
  Top 0.406: RJ45_0_.T_6 132.59,81.92 132.21,81.92 131.44,81.15 131.44,80.01 129.16,77.72 129.16,75.56 128.27,74.68 125.86,74.68 v124.71,73.53 | v119.63,68.45 115.82,64.64 115.82,60.45 114.55,59.18 114.55,34.54 v113.03,33.02 | R16.1 77.47,20.32 v85.09,27.94
  Bottom 0.406: v124.71,73.53 v119.63,68.45 | v85.09,27.94 90.17,33.02 v113.03,33.02
GND  (via drill 0.3, 0.6, 1.07)
  Top 0.305: MCU.54 74.35,46.41 74.93,46.99 | MCU.6 66.35,21.9 v66.04,21.08 | MCU.37 88.38,33.79 | MCU.83 60.87,36.79 v60.58,37.08
  other vias: 146.05,88.9 144.78,97.79 19.94,29.84 66.04,16.38 6.35,20.32 8.89,20.32 148.72,76.58 148.84,79.76 151,79.38 147.96,51.05 150.24,56.9 150.11,52.96 87.88,33.4 87.63,36.83 88.01,69.98 125.09,69.34 128.27,68.58 132.08,68.58 134.62,67.31 75.95,35.81 70.99,29.21 65.91,33.4 83.82,67.56 83.82,68.58 125.09,63.25 96.01,34.92 71.12,38.1 100.33,40.26 38.48,38.86 30.48,38.1 124.46,55.88 129.03,48.01 125.48,49.53 95.12,48.13 89.79,48.26 84.45,48.26 76.45,48.51 62.36,48.01 39.37,7.62 34.29,5.08 93.98,16.51 92.71,22.86 78.74,19.05 128.27,10.16 121.92,6.35 120.65,13.97 127,24.13 117.22,32.89 123.95,32.38 118.11,40.51 120.4,42.8 154.69,34.8 150.75,34.54 158.37,41.78 157.61,45.21 140.59,78.61 131.57,85.22
  pour Bottom: -2.54,101.6 162.56,101.6 162.56,-2.54 -2.54,-2.54
  pour Top: -5.08,104.14 165.1,104.14 165.1,-5.08 -5.08,-5.08
LED0  (via drill 0.3)
  Top 0.305: MCU.44 80.34,37.29 82.17,39.12 84.07,39.12 85.6,40.64 v93.47,40.64 | v110.49,44.45 109.86,43.81 4-NMOS.6
  Bottom 0.305: v93.47,40.64 93.85,40.64 97.66,44.45 v110.49,44.45
LED0_O
  Top 0.406: R30.5 106.77,48.12 arc90 D0.C
LED1  (via drill 0.3)
  Top 0.305: MCU.47 81.08,38.79 81.92,39.62 83.31,39.62 v83.57,39.88 | v110.62,38.86 108.85,38.86 4-NMOS.2
  Bottom 0.305: v83.57,39.88 85.47,39.88 86.74,38.61 97.66,38.61 98.55,39.5 109.98,39.5 v110.62,38.86
LED1_O
  Top 0.406: R30.6 105.81,49.7 arc-90 D1.C
LED2  (via drill 0.3)
  Top 0.305: MCU.42 80.99,36.29 v81.15,36.45 | v100.33,38.73 4-NMOS.13
  Bottom 0.305: v81.15,36.45 82.42,37.72 98.04,37.72 99.06,38.73 v100.33,38.73
LED2_O
  Top 0.406: R30.7 105.01,49.7 arc90 D2.C
LED3  (via drill 0.3)
  Top 0.305: MCU.43 80.61,36.79 82.42,38.61 84.45,38.61 85.85,40.01 94.11,40.01 v94.74,40.64 | v100.2,43.81 4-NMOS.9
  Bottom 0.305: v94.74,40.64 97.03,40.64 v100.2,43.81
LED3_O
  Top 0.406: R30.8 104.05,48.12 arc-90 D3.C
LED_ERROR  (via drill 0.3)
  Top 0.305: MCU.51 75.85,42.83 76.2,43.18 78.61,43.18 80.01,44.58 80.01,53.34 82.42,55.75 v82.42,59.44 | v82.42,65.53 v82.42,68.71 | v82.42,70.74 v88.52,70.74 | v90.55,70.74 91.57,70.74 92.08,70.23 4-NMOS1.9
  Bottom 0.305: v82.42,59.44 v82.42,65.53 | v82.42,68.71 v82.42,70.74 | v88.52,70.74 v90.55,70.74
LED_RUN
  Top 0.305: 4-NMOS1.2 87,58.42 81.41,52.83 81.41,41.66 79.04,39.29 MCU.48
LED_START  (via drill 0.3)
  Top 0.305: 4-NMOS1.6 92.08,59.56 v91.31,58.8 | v83.31,58.8 83.31,55.75 80.64,53.09 80.64,44.32 78.99,42.67 78.99,40.77 78.52,40.29 MCU.50
  Bottom 0.305: v91.31,58.8 v83.31,58.8
LED_STAT1  (via drill 0.3)
  Top 0.305: MCU.86 41.29,35.29 40.89,35.69 39.24,35.69 v38.99,35.94 | v36.45,35.94 16.13,35.94 15.11,36.96 15.11,37.97 14.48,38.61 13.35,38.61 4-NMOS2.2
  Bottom 0.305: v38.99,35.94 v36.45,35.94
LED_STAT2  (via drill 0.3)
  Top 0.305: MCU.87 40.64,34.79 v40.39,35.04 | 4-NMOS2.13 4.45,38.73 4.45,35.69 5.08,35.05 v37.34,35.05
  Bottom 0.305: v37.34,35.05 39.37,35.05 v40.39,35.04
LED_STAT3  (via drill 0.3)
  Top 0.305: 4-NMOS2.3 4-NMOS2.4 14.48,41.27 | 14.48,41.27 14.99,41.78 14.99,43.31 14.48,43.81 4-NMOS2.6 4-NMOS2.7 | v48.9,37.34 v46.48,37.34 | v48.9,34.04 49.15,34.29 MCU.88 | v36.32,39.24 35.05,40.51 v34.04,40.51 | v32,40.51 31.24,40.51 30.99,40.26 15.49,40.26 14.48,41.27
  Bottom 0.305: v48.9,34.04 v48.9,37.34 | v46.48,37.34 38.23,37.34 v36.32,39.24 | v34.04,40.51 33.78,40.26 32.26,40.26 v32,40.51
LED_STAT4  (via drill 0.3)
  Top 0.305: MCU.89 51.19,33.79 50.67,33.27 47.88,33.27 v47.62,33.53 | v47.62,36.7 v45.34,36.7 | v38.23,36.7 37.85,36.7 v34.8,39.75 | v31.5,39.75 v14.86,39.75 | v4.95,43.05 4.95,43.56 5.21,43.81 4-NMOS2.9
  Bottom 0.305: v47.62,33.53 v47.62,36.7 | v45.34,36.7 v38.23,36.7 | v34.8,39.75 v31.5,39.75 | v14.86,39.75 8.26,39.75 v4.95,43.05
LED_STOP  (via drill 0.3)
  Top 0.305: MCU.52 75.35,43.47 75.69,43.81 78.36,43.81 79.38,44.83 79.38,53.59 81.79,56.01 v81.79,60.33 | v81.79,64.39 81.79,68.96 82.93,70.1 86.36,70.1 87,69.47 4-NMOS1.13
  Bottom 0.305: v81.79,60.33 v81.79,64.39
MCU_RST  (via drill 0.3, 0.51, 0.6)
  Top 0.305: JTAG.6 v58.42,26.67 | v58.42,29.21 58.63,29.29 MCU.98
  Top 0.406: R23.1 54.61,10.59 RESET.3 C10.2 | v57.15,13.97 57.15,17.78 JTAG.6 | v56.52,55.5 v57.78,48.51
  Bottom 0.305: v58.42,26.67 v58.42,29.21 57.78,30.35 | RJ45_2_.T_5 85.98,77.22 85.98,75.56 83.95,73.53 56.52,73.53 v56.52,55.5
  Bottom 0.406: v57.15,13.97 56.87,13.69 RESET.3 | v57.78,48.51 57.78,30.35
MFLOW  (via drill 0.3)
  Top 0.406: RJ45_3_.T_3 v108.58,74.43 v108.58,74.42 | v111.76,52.58 111.76,36.83 106.68,31.75 v106.68,6.35 | v125.73,54.61 v120.78,54.61 | v99.69,7.62 v96.14,7.62 | 91.5,6.29 91.44,6.35 R13.2 91.5,6.71 v91.5,5.4 91.5,6.29
  Bottom 0.406: v108.58,74.42 108.58,74.3 125.73,57.15 v125.73,54.61 | v106.68,6.35 105.54,5.21 102.74,5.21 100.33,7.62 v99.69,7.62 | v120.78,54.61 113.16,54.61 111.76,53.21 v111.76,52.58 | v96.14,7.62 93.85,5.33 91.57,5.33 v91.5,5.4
MFLOW(S)  (via drill 0.3)
  Top 0.305: R14.2 R13.1 v91.44,10.16 | MCU.25 75.85,25.62 76.58,24.89 v77.22,24.89
  Bottom 0.305: v77.22,24.89 77.72,24.89 91.44,11.18 v91.44,10.16
MODEBTN1  (via drill 0.3)
  Top 0.305: R11.1 122.77,20.75 C23.2 121.07,18.2 v120.65,17.78 | MCU.33 85.81,31.79 90.3,27.3 93.34,27.3 v96.52,24.13
  Bottom 0.305: v120.65,17.78 113.87,17.78 MODEBTN1.3 111.38,20.27 111.38,20.83 110.74,21.46 99.19,21.46 v96.52,24.13
MODEBTN2  (via drill 0.3)
  Top 0.305: C27.2 101.18,17.35 | 101.18,17.35 R12.1 100.11,18.41 v99.31,18.41 | MODEBTN2.3 103.16,19.33 101.18,17.35 | MCU.32 85.55,31.29 90.3,26.54 93.22,26.54 v95,24.77
  Bottom 0.305: v95,24.77 99.06,20.7 99.06,18.67 v99.31,18.41
MODEBTN3  (via drill 0.3)
  Top 0.305: MCU.31 85.29,30.79 90.17,25.91 92.84,25.91 95.63,23.11 v98.93,23.11 | v102.49,22.23 103.63,22.23 105.28,20.57 105.28,13.56 MODEBTN3.3 103.43,10.45 | 103.43,10.45 R58.1 | C28.2 102.72,9.74 103.43,10.45
  Bottom 0.305: v98.93,23.11 101.6,23.11 v102.49,22.23
MODEBTN4  (via drill 0.3)
  Top 0.305: MODEBTN4.3 112.32,10.45 R64.1 C29.2 | MCU.30 85.03,30.29 90.17,25.15 v92.46,25.15 | v115.57,24.13 v115.57,14.96
  Bottom 0.305: v92.46,25.15 93.98,25.15 94.36,25.53 114.17,25.53 v115.57,24.13 | v115.57,14.96 MODEBTN4.3
MOTORREL_R
  Top 0.61: U$7.A 149.63,83.27 LED3.C 147.32,83.82 | 147.32,83.82 146.05,82.55 U$5.D | RJ45_0_.B_2 136.53,87 138.43,88.9 142.24,88.9 147.32,83.82
N$1  (via drill 1.07)
  other vias: 19.05,20.32
N$2
  Top 0.406: R30.4 106.61,42.55 4-NMOS.5
N$3
  Top 0.305: MCU.12 69.35,20.82 70.25,19.92 R26.2
N$4
  Top 0.406: R30.3 105.81,37.47 4-NMOS.1
N$5
  Top 0.305: MCU.13 69.85,21.59 71.12,20.32 71.05,20.25 R26.1
N$6  (via drill 0.3)
  Top 0.305: MCU.39 v81.92,34.79 C7.1 | C6.1 91.35,34.8 v86.49,34.8
  Top 0.61: C14.1 91.81,34.24 C6.1
  Bottom 0.305: v86.49,34.8 86.48,34.79 v81.92,34.79
N$7
  Top 0.406: R30.2 105.01,37.47 4-NMOS.14
N$8
  Top 0.406: R30.1 104.21,42.55 4-NMOS.10
N$9
  Top 0.305: MCU.40 81.43,35.29 82.46,36.32 C9.1 86.02,39.37 C16.1 95.62,41.86 C8.1
N$10
  Top 0.305: MCU.23 74.85,23.56 C12.1
N$11
  Top 0.305: MCU.24 75.35,24.86 C12.2
N$12  (via drill 1.07)
  other vias: 6.35,10.16
N$13  (via drill 1.07)
  other vias: 6.35,12.7
N$14
  Top 0.61: R5.1 LED9.A
N$15
  Top 0.61: U$39.G 148.14,90.68 152.65,90.68 153.25,90.08 R19.2 R10.2
N$16
  Top 0.61: LED9.C 106.68,59.92 U$18.D
N$17
  Top 0.61: PWR_LED.A 153.95,26.44 152.91,25.4 152.91,22.95 R84.1
N$18
  Top 0.61: U$5.G 148.14,77.98 152.4,77.98 153.25,77.13 R8.2 R3.2
N$19
  Top 0.61: LED2.A R83.1
N$20  (via drill 0.3, 0.6)
  Top 0.305: R31.2 R32.2
  Top 0.61: U$6.G 147.83,65.59 v147.83,64.77 | v125.22,52.58 125.09,52.7 120.4,52.7 119.38,51.69 119.38,27.94 125.22,22.1 v125.22,4.45 | v100.58,6.35 v96.14,6.35 | v40.64,15.62 R32.2 | v43.05,4.95 v43.05,13.21
  Bottom 0.61: v147.83,64.77 147.57,64.52 135.38,64.52 133.99,63.12 131.83,63.12 129.54,60.83 129.54,52.83 129.29,52.58 v125.22,52.58 | v125.22,4.45 102.49,4.45 v100.58,6.35 | v96.14,6.35 94.23,4.45 43.05,4.45 v43.05,4.95 | v43.05,13.21 v40.64,15.62
N$21
  Top 0.305: MCU.14 70.35,22.36 72.46,20.25 R25.4
N$25
  Top 0.406: R7.5 98.83,63.57 LSTART.C
N$26
  Top 0.406: R7.6 97.79,64.37 97.79,67.06 98.83,67.06 LRUN.C
N$27
  Top 0.305: MCU.15 70.85,23.13 73.26,20.72 R25.3
N$28
  Top 0.305: MCU.16 71.35,23.9 74.06,21.19 R25.2
N$29
  Top 0.305: MCU.17 71.85,24.67 74.86,21.66 R25.1
N$32
  Top 0.406: R7.4 90.81,63.57 4-NMOS1.5
N$33
  Top 0.406: R7.3 85.72,64.37 4-NMOS1.1
N$34
  Top 0.813: R1.1 147.55,24.13 PWR_12.A
N$35
  Top 0.61: LED3.A R24.1
N$39
  Top 0.406: R65.4 11.11,42.55 4-NMOS2.5
N$40
  Top 0.406: R65.3 10.31,37.47 4-NMOS2.1
N$41
  Top 0.406: R65.2 9.51,37.47 4-NMOS2.14
N$42
  Top 0.406: R65.1 8.71,42.55 4-NMOS2.10
N$43
  Top 0.406: LSTAT3.C 13.72,51.49 R65.5
N$44
  Top 0.406: R7.2 85.72,65.17 4-NMOS1.14
N$45
  Top 0.406: R7.1 90.81,65.97 4-NMOS1.10
N$46
  Top 0.406: R7.7 97.16,65.17 97.16,69.6 98.83,69.6 LSTOP.C
N$47
  Top 0.406: 98.83,72.01 LERROR.C 98.83,71.88 96.52,71.88 96.52,65.97 R7.8
N$48
  Top 0.61: U$8.G 149.16,54.1 152.4,54.1 153.25,53.25 R35.2 R34.2
N$49
  Top 0.61: LED4.A R33.1
N$50
  Top 0.406: R65.6 10.31,50.97 LSTAT1.C
N$51
  Top 0.61: U$10.G 50.54,89.4 50.04,88.9 44.45,88.9 43.6,88.05 R18.2 R37.2
N$52
  Top 0.406: R65.7 9.51,50.97 LSTAT2.C
N$53
  Top 0.61: LED5.A R36.1
N$54  (via drill 0.3)
  Top 0.305: R28.2 R27.2 40.68,54.23 v43.05,52.96 | v122.3,50.42 v125.22,47.5 | v125.22,44.7 124.46,43.94 124.46,42.93 125.09,42.29 125.6,42.29 127.26,40.63 U$16.G
  Top 0.406: v57.53,52.96 60.07,49.53 v62.23,49.53
  Bottom 0.305: v43.05,52.96 v57.53,52.96 | v62.23,49.53 63.12,49.53 64.01,50.42 v122.3,50.42 | v125.22,47.5 v125.22,44.7
N$55
  Top 0.406: LSTAT4.C 6.1,51.49 R65.8
N$56
  Top 0.61: R40.2 R39.2 25.82,88.05 26.67,88.9 32.26,88.9 32.76,89.4 U$12.G
N$57
  Top 0.61: R38.1 LED6.A
N$58  (via drill 1.07)
  other vias: 6.35,15.24
N$59  (via drill 1.07)
  other vias: 8.89,15.24
N$60
  Top 0.61: R43.2 R42.2 25.82,76.62 26.67,77.47 32.26,77.47 32.76,77.97 U$14.G
N$61
  Top 0.61: R41.1 LED7.A
N$62  (via drill 0.3, 0.51)
  Top 0.305: R50.2 30.48,57.15 | R51.2 30.48,57.15 | 30.48,57.15 31.5,57.15 v32,53.85 | v121.16,51.18 v125.86,51.18 | v127.25,31.37 v127.26,31.36 U$21.G
  Top 0.406: v58.17,53.85 60.71,50.67 v62.23,50.67
  Bottom 0.305: v62.23,50.67 62.99,50.67 63.5,51.18 v121.16,51.18 | v125.86,51.18 126.75,50.29 126.75,43.18 125.86,42.29 124.97,42.29 124.46,41.78 124.46,36.83 127.25,34.04 v127.25,31.37 | v58.17,53.85 v32,53.85
N$63  (via drill 1.07)
  other vias: 8.89,12.7
N$64  (via drill 1.07)
  other vias: 8.89,10.16
N$65
  Top 0.61: R44.1 LED8.A
N$68  (via drill 0.3, 0.51)
  Top 0.305: R53.2 R54.2 25.74,55.46 v26.16,54.61 | v122.3,51.82 127.19,51.82 U$19.G
  Top 0.406: v62.23,51.82 59.56,53.34 v59.56,54.61
  Bottom 0.305: v62.23,51.82 v122.3,51.82 | v26.16,54.61 v59.56,54.61
N$69
  Top 0.61: U$18.G 108.63,64.51 R6.2 110.91,60.12 R17.2
N$70
  Top 0.61: LED1.A R66.1
N$71  (via drill 1.07)
  other vias: 11.43,7.62
N$72  (via drill 1.07)
  other vias: 11.43,10.16
N$73
  Top 0.61: LED10.A R52.1
N$74  (via drill 1.07)
  other vias: 11.43,12.7
N$75  (via drill 1.07)
  other vias: 11.43,15.24
N$76
  Top 0.61: LED11.A R55.1
N$77  (via drill 1.07)
  other vias: 13.97,15.24
N$78  (via drill 1.07)
  other vias: 13.97,12.7
N$79  (via drill 1.07)
  other vias: 13.97,10.16
N$80  (via drill 1.07)
  other vias: 13.97,7.62
N$81  (via drill 1.07)
  other vias: 16.51,7.62
N$82  (via drill 1.07)
  other vias: 16.51,10.16
N$83  (via drill 1.07)
  other vias: 16.51,12.7
N$84  (via drill 1.07)
  other vias: 16.51,15.24
N$85  (via drill 1.07)
  other vias: 19.05,15.24
N$86  (via drill 1.07)
  other vias: 19.05,12.7
N$87  (via drill 1.07)
  other vias: 19.05,7.62
N$88  (via drill 1.07)
  other vias: 19.05,10.16
N$91  (via drill 0.3)
  Top 0.305: R45.1 58.42,14.22 58.93,14.73 v60.07,14.73 | v62.1,14.73 62.23,14.86 62.23,17.78 JTAG.8
  Bottom 0.305: v60.07,14.73 v62.1,14.73
N$92  (via drill 1.07)
  other vias: 6.35,17.78
N$93  (via drill 1.07)
  other vias: 8.89,17.78
N$94  (via drill 1.07)
  other vias: 11.43,17.78
N$95  (via drill 1.07)
  other vias: 13.97,17.78
N$96  (via drill 1.07)
  other vias: 16.51,17.78
N$97  (via drill 1.07)
  other vias: 19.05,17.78
N$99  (via drill 1.07)
  other vias: 16.51,20.32
N$100  (via drill 1.07)
  other vias: 13.97,20.32
N$101  (via drill 1.07)
  other vias: 11.43,20.32
OP1_R  (via drill 0.3)
  Top 0.305: v61.34,88.27 v61.34,79.88 | v34.29,80.01 34.29,81.41 33.4,82.3 32.38,82.3 31.88,81.79 31.88,80.14 U$14.D
  Top 0.61: U$14.D 29.44,82.32 LED8.C 29.44,83.27 U$17.A
  Bottom 0.305: RJ45_1_.B_5 66.67,89.15 65.79,88.27 v61.34,88.27 | v61.34,79.88 34.42,79.88 v34.29,80.01
OP-1  (via drill 0.3)
  Top 0.305: R68.4 25.08,26.6 v25.78,27.3 | MCU.95 43.63,30.79 42.29,32.13 30.86,32.13 v30.48,32.51
  Bottom 0.305: v25.78,27.3 26.04,27.56 29.97,27.56 30.48,28.07 V2.12 v30.48,32.51
OP-1S  (via drill 0.3)
  Top 0.305: v36.2,27.56 41.4,27.56 42.42,28.57 v59.31,28.57
  Top 0.406: R10.1 157.06,87.59 v156.84,87.38 | v143,68.07 143,52.58 140.46,50.04 140.46,46.35 139.7,45.59 v120.27,45.59 | v61.98,45.59 61.09,45.59 v59.31,40.13
  Bottom 0.305: v36.2,27.56 33.66,27.56 33.02,28.19 V2.11 | 59.31,29.72 v59.31,28.57
  Bottom 0.406: v156.84,87.38 158.62,85.6 158.62,74.8 157.48,73.66 148.59,73.66 v143,68.07 | v120.27,45.59 v61.98,45.59 | v59.31,40.13 59.31,29.72
OP-2  (via drill 0.3)
  Top 0.305: R68.3 26.18,25.8 v27.18,26.8 | MCU.94 44.02,31.29 42.55,32.77 38.23,32.77 v38.1,32.89
  Bottom 0.305: v27.18,26.8 36.58,26.8 37.85,28.07 37.85,28.96 V2.9 v38.1,32.89
OP-2S  (via drill 0.3)
  Top 0.305: v52.83,29.21 V2.8
  Top 0.406: R3.1 157.06,75.02 156.59,74.55 v148.46,74.55 | v141.99,68.45 141.99,52.96 139.45,50.42 139.45,46.86 138.94,46.35 v120.9,46.35 | v62.61,46.35 60.71,46.35 v53.72,40.51
  Bottom 0.406: v148.46,74.55 148.08,74.55 v141.99,68.45 | v120.9,46.35 v62.61,46.35 | v53.72,40.51 53.72,30.73 v52.83,29.21
OP-3  (via drill 0.3)
  Top 0.305: R68.2 26.18,25 v27.18,24 | MCU.93 44.66,31.79 v44.45,32 | v44.45,27.18 44.45,26.67 42.42,24.64 v36.7,24.64
  Bottom 0.305: v27.18,24 30.61,24 V2.4 36.07,24.64 v36.7,24.64 | v44.45,32 v44.45,27.18
OP-3S
  Top 0.305: V2.6 R31.1
OP-4  (via drill 0.3)
  Top 0.305: V2.1 24.82,21.59 R68.1 | MCU.92 45.43,32.29 44.83,32.89 v43.56,32.89
  Bottom 0.305: v43.56,32.89 43.56,27.05 39.37,22.86 39.37,19.81 27.18,19.81 V2.1
OP-4S  (via drill 0.3, 0.6)
  Top 0.61: R34.1 157.48,51.65 v157.48,49.53 | v139.7,43.18 137.79,41.27 v133.86,41.27 | v125.48,41.27 122.81,41.27 120.65,39.12 v120.65,28.57 | v99.69,8.89 v96.01,8.89 | v32.64,16.89 30.48,19.05 V2.3
  Bottom 0.61: v157.48,49.53 154.94,46.99 143.51,46.99 v139.7,43.18 | v133.86,41.27 v125.48,41.27 | v120.65,28.57 121.92,27.3 121.92,10.16 117.22,5.46 111.89,5.46 108.46,8.89 v99.69,8.89 | v96.01,8.89 89.66,8.89 86.87,6.1 35.18,6.1 32.64,8.64 v32.64,16.89
OP-5
  Top 0.305: MCU.91 45.82,32.79 44.96,33.66 38.31,33.66 37.97,34 37.97,35.69 34.71,38.95 R63.1 V1.9
OP-5S  (via drill 0.3, 0.6)
  Top 0.305: R18.1 47.37,85.56 v47.37,74.3
  Top 0.406: v48.9,48.26 48.9,72.77 v47.37,74.3
  Bottom 0.305: v47.37,74.3 48.9,72.77 | v48.9,48.26 47.62,46.99 33.02,46.99 30.48,44.45 V1.8
OP-6
  Top 0.305: MCU.85 45.36,35.79 42.16,38.99 40.68,38.99 R62.1 V1.12
OP-6S  (via drill 0.6)
  Top 0.305: R39.1 34.29,87.63 38.1,83.82 38.1,73.66
  Top 0.406: v49.91,45.72 v49.91,56.52 | v38.1,56.52 38.1,73.66
  Bottom 0.305: 48.26,44.45 39.37,44.45 38.1,43.18 V1.11
  Bottom 0.406: 48.26,44.45 v49.91,45.72 | v49.91,56.52 v38.1,56.52
OP-7
  Top 0.305: R61.1 V1.4 41.91,45.72 41.91,40.64 43.69,38.86 49.02,38.86 51.59,36.29 MCU.84
OP-7S
  Top 0.305: R42.1 31.5,76.2 34.92,72.77 34.92,51.44 V1.6
OP-8
  Top 0.305: MCU.81 50.98,37.79 49.28,39.5 45.59,39.5 44.45,40.64 44.45,48.26 V1.1 R60.1
OP-8S
  Top 0.305: V1.3 R27.1
OP-9  (via drill 0.3, 0.6)
  Top 0.305: V3.4 R59.1 25.49,59.18 27.3,59.18 v27.94,55.37 | MCU.80 51.63,38.29 51.05,39.62
  Top 0.406: 51.05,39.62 v51.05,55.37
  Bottom 0.406: v51.05,55.37 v27.94,55.37
OP-9S
  Top 0.305: V3.6 R50.1
OP-10
  Top 0.305: R4.1 V3.1
OP-10S
  Top 0.305: R53.1 V3.3
OP_8S_R  (via drill 0.3)
  Top 0.61: U$20.A U$16.D 128.27,42.95 LED1.C v125.48,43.18 | RJ45_2_.B_8 84.45,82.56 85.72,81.28 85.72,79.12 87,77.85 v87,73.53
  Bottom 0.61: v87,73.53 87.38,73.15 103.89,73.15 124.21,52.83 124.21,44.45 v125.48,43.18
OP_9S_R  (via drill 0.3)
  Top 0.61: U$23.A U$21.D 128.27,32.79 LED10.C 126.62,33.02 v126.11,33.53 | v124.71,53.59 v122.17,53.59
  Bottom 0.61: RJ45_2_.T_8 95.12,85.09 98.04,85.09 99.57,83.57 99.57,80.77 101.98,78.36 101.98,75.82 102.87,74.93 103.38,74.93 v124.71,53.59 | v122.17,53.59 123.32,52.45 123.32,36.32 v126.11,33.53
OP_10S_R  (via drill 0.3)
  Top 0.305: v128.02,56.26 128.02,54.63 LED11.C
  Top 0.61: U$24.A U$19.D 128.27,54.38 LED11.C
  Bottom 0.305: RJ45_3_.T_6 112.39,74.68 128.02,59.05 v128.02,56.26
OPENLOG_DTR  (via drill 0.3)  (1 unrouted)
  Top 0.305: MCU.57 72.85,52.02 73.79,52.96 v73.79,57.4
  Bottom 0.305: v73.79,57.4 73.79,57.66 71.88,59.56
OPENLOG_RX  (via drill 0.3, 0.6)  (2 unrouted)
  Top 0.305: MCU.56 73.35,51.63 74.42,52.7 74.42,57.78 73.79,58.42 v73.79,62.74
  Top 0.406: v15.24,66.04 15.24,71.12 5.08,71.12 SCREWTERMINAL.8
  Bottom 0.305: v73.79,62.74 66.55,62.74 64.52,64.77
OPENLOG_TX  (via drill 0.3)  (2 unrouted)
  Top 0.305: MCU.55 73.85,51.24 75.06,52.45 75.06,57.91 74.42,58.55 v74.42,61.72
  Bottom 0.305: v74.42,61.72 63.37,61.72
PC21  (via drill 0.3)  (1 unrouted)
  Top 0.305: MCU.69 66.85,58.75 | 46.74,73.79 v46.74,82.93
  Bottom 0.305: SCREWTERMINAL.1 14.48,86.36 43.31,86.36 v46.74,82.93
PC22  (via drill 0.3)  (1 unrouted)
  Top 0.305: MCU.70 66.35,58.36 | 46.1,73.53 46.1,82.55 42.93,85.72 v39.37,85.72
  Bottom 0.305: SCREWTERMINAL.2 11.62,85.72 v39.37,85.72
PC23  (via drill 0.3)  (1 unrouted)
  Top 0.305: MCU.71 65.85,58.1 | 45.47,73.41 45.47,82.17 v42.55,85.09
  Bottom 0.305: SCREWTERMINAL.3 8.75,85.09 v42.55,85.09
PC24  (via drill 0.3)  (1 unrouted)
  Top 0.305: MCU.72 65.35,57.84 | 44.83,73.28 44.83,81.79 42.16,84.45 v39.37,84.45
  Bottom 0.305: SCREWTERMINAL.4 5.88,84.45 v39.37,84.45
PC31  (via drill 0.3)  (1 unrouted)
  Top 0.305: MCU.73 64.85,57.58 | 44.2,73.15 44.2,81.41 v41.78,83.82
  Bottom 0.305: SCREWTERMINAL.5 7.14,83.82 v41.78,83.82
PD0  (via drill 0.3)  (1 unrouted)
  Top 0.305: MCU.74 64.35,57.32 | 43.56,73.03 43.56,81.03 41.4,83.19 v39.37,83.19
  Bottom 0.305: SCREWTERMINAL.6 10.01,83.19 v39.37,83.19
PURGEVLV_V_R  (via drill 0.3)
  Top 0.305: RJ45_1_.B_3 | 29.46,95.27 LED7.C
  Top 0.61: U$15.A 26.18,91.99 LED7.C 29.44,93.75 U$12.D | RJ45_1_.B_3 69.22,90.3 68.2,91.31 61.72,91.31 60.96,90.55 60.96,89.79 60.07,88.9 58.55,88.9 57.02,90.42 v57.02,97.03 | v29.46,97.03 29.46,95.27
  Bottom 0.61: v57.02,97.03 v29.46,97.03
RESREL_R  (via drill 0.6)
  Top 0.61: 147.32,60.96 LED5.C 152.89,57.7 U$11.A | 147.32,60.96 146.05,59.69 U$8.D | 147.32,60.96 147.32,62.23 v146.05,63.5 | v137.16,63.5 v137.16,68.58
  Bottom 0.61: v146.05,63.5 v137.16,63.5 | v137.16,68.58 137.16,74.04 135,76.2 135,77.47 138.56,81.03 138.56,84.33 137.79,85.09 134.62,85.09 RJ45_0_.B_4
START(S)  (via drill 0.3, 0.51, 0.6)
  Top 0.305: C25.1 39.79,13.12 54.1,27.43 55.5,27.43 | MCU.100 61.18,28.29 60.33,27.43 55.5,27.43 | v55.5,27.3 55.5,27.43
  Top 0.406: START1.P$1 30.48,13.12 R21.1 C25.1 | v55.5,56.52 v55.5,48.26
  Bottom 0.305: RJ45_2_.T_3 86.99,80.64 84.45,78.11 80.26,78.11 76.33,74.17 55.5,74.17
  Bottom 0.406: 55.5,74.17 v55.5,56.52 | v55.5,48.26 v55.5,27.3
STARTUPREL_R
  Top 0.61: U$42.A 152.89,93.26 LED2.C 147.32,96.52 146.05,95.25 U$39.D 140.59,92.71 136.76,91.15 | 136.76,91.15 136.53,91.06 | RJ45_0_.B_1 136.52,90.91 136.76,91.15
SUPPLYVLV_V_R  (via drill 0.3)
  Top 0.61: U$13.A 47.22,94.7 LED6.C 47.22,93.75 U$10.D 49.53,93.22 v50.29,93.98
  Bottom 0.61: RJ45_1_.B_1 69.09,92.2 59.82,92.2 57.91,93.98 v50.29,93.98
SYS_OK  (via drill 0.3)
  Top 0.305: MCU.99 60.54,28.79 59.69,27.94 43.69,27.94 42.42,25.91 41.91,25.4 v35.56,25.4 | v35.56,25.4 V2.5 | V2.2 v27.94,25.4 V2.13 | V2.10 v35.56,25.4 | V1.10 v35.56,46.23 V1.5 v35.56,60.2 v35.56,74.93 | V1.13 v43.18,46.23 V1.2 | R2.2 V3.2 | R6.1 108.8,66.04 v105.41,66.04 | v88.14,72.26 85.47,72.26 83.31,74.42 83.31,79.63 RJ45_2_.T_1
  Bottom 0.305: v35.56,25.4 v27.94,25.4 | v43.18,46.23 v35.56,46.23 | V2.10 V1.10 | RJ45_2_.T_1 82.42,78.74 80.01,78.74 76.2,74.93 v35.56,74.93 | v105.41,66.04 99.19,72.26 v88.14,72.26 | v35.56,60.2 27.94,60.2 | 27.94,60.2 V3.5 | V3.2 21.21,60.2 27.94,60.2
TCK  (via drill 0.3)
  Top 0.305: MCU.1 63.85,21.69 v63.25,21.08 | v54.86,20.7 54.74,20.57 54.74,17.91 JTAG.1
  Bottom 0.305: v63.25,21.08 55.24,21.08 v54.86,20.7
TDI
  Top 0.305: MCU.2 64.35,20.74 64.77,20.32 64.77,17.78 JTAG.9
TDO  (via drill 0.3)
  Top 0.305: MCU.3 64.85,21.38 65.28,20.95 v65.28,15.62
  Bottom 0.305: v65.28,15.62 65.02,15.37 56.01,15.37 55.88,15.49 JTAG.3
TMS  (via drill 0.3)
  Top 0.305: MCU.4 65.35,22.41 v65.66,22.1 | v59.69,22.1 59.69,17.78 JTAG.5
  Bottom 0.305: v65.66,22.1 v59.69,22.1
USB_N
  Top 0.305: MCU.35 86.27,32.79 90.5,28.56 JP2.D-
USB_P
  Top 0.152: 96.52,29.18 96.44,29.18 JP2.D+
  Top 0.305: MCU.36 86.41,33.29 90.49,29.21 JP2.D+
USB_VBUS
  Top 0.305: MCU.34 86.07,32.29 90.45,27.91 JP2.VBUS
VCC  (via drill 0.3, 0.6, 0.8, 1.07)  (1 unrouted)
  Top 0.305: R58.2 v104.14,1.65 | MCU.82 66.85,37.29 72.39,31.75 69.85,31.75 65.85,27.75 MCU.5 | 74.85,32.94 MCU.53 74.85,43.82 C5.1 | R64.2 v113.03,1.52 | R11.2 121.07,22.01 121.92,22.86 123.44,22.86 124.33,21.97 v124.33,1.52 | R12.2 99.25,20.98 99.25,21.4 | R45.2 60.96,10.58 | 60.96,10.58 63.28,10.58 64.14,11.43 U$4.3 | JTAG.7 60.96,10.58 | MCU.38 76.2,34.29 74.85,32.94 | 74.85,32.94 74.85,32.64
  Top 0.406: R22.1 R22.2 | 54.7,8.13 R23.2
  Top 0.61: LD39300-NNP.3 151.89,41.65 155.7,45.47 155.7,47.24 155.14,47.8 JP1.1 | 74.85,32.64 74.85,31.67 v73.66,30.48 72.39,31.75 | LRUN.A 101.83,72.16 101.6,72.39 v101.6,74.3 | RJ45_2_.T_4 88.26,75.44 v89.41,74.3 89.53,74.17 4-NMOS1.11 v89.53,66.29 | v84.2,66.29 84.2,62.1 83.43,61.33 C13.1 82.5,61.38 C4.1 | R45.2 58.42,8.89 57.66,8.13 54.7,8.13 | R22.1 134.18,64.46 134.75,65.02 v134.75,65.91 | JP4.1 147.19,48.95 147.19,49.4
  Top 0.813: L1.2 v97.79,10.58 | 100.33,19.94 R12.2 | 4-NMOS.11 99.69,41.27 99.06,40.64 99.06,53.34 101.37,53.34 D3.A | D3.A D2.A D1.A D0.A | D3.A v101.6,56.77 | v101.6,60.2 101.6,64.54 LSTART.A LRUN.A LSTOP.A LERROR.A | v97.79,19.94 97.98,19.24 97.98,20.13 | R23.2 v54.61,1.52
  Top 1.016: LD39300-NNP.3 148.84,43.66 148.84,45.97 148.08,46.74 148.08,48.51 147.19,49.4 144.4,52.2 v144.4,65.91 | LSTAT4.A 6.1,58.42 | LSTAT2.A 8.64,58.42 | LSTAT1.A 11.18,58.42 | LSTAT3.A 13.72,58.42 | 4-NMOS2.11 2.67,41.27 v2.54,41.4 | U$36.3 v19.56,31.11
  Top 1.422: v97.79,10.58 v97.79,19.94 97.98,20.13 99.25,21.4 101.6,23.75 101.6,34.29 99.06,36.83 99.06,40.64
  Top 1.676: SCREWTERMINAL.9 8.89,67.76 8.89,58.42
  Top 1.778: C17.1 152.77,19 C18.1 152.82,21.08 155.19,21.08 155.19,22.86 | 155.19,22.86 R84.2 | 155.19,22.86 157.48,22.86 157.48,39.24 C1.1 153.26,39.24 LD39300-NNP.3
  Top 2.184: POWER.15 POWER.16 | POWER.16 151.97,12.7 C15.+ | POWER.16 149.86,14.41 C11.+ 149.02,16.51 C17.1
  Top 2.54: v149.86,2.54 POWER.15 | v2.54,58.42 6.1,58.42 8.64,58.42 8.89,58.42 11.18,58.42 13.72,58.42
  Bottom 0.305: v113.03,1.52 113.03,2.54 | v104.14,1.65 104.14,2.54 | v124.33,1.52 124.33,2.41 124.46,2.54 | JTAG.7 59.69,17.78 57.15,17.78 JTAG.4
  Bottom 0.406: v54.61,1.52 54.61,2.54
  Bottom 0.61: START1.P$2 30.48,2.54 | v101.6,74.3 v89.41,74.3 | v89.53,66.29 v84.2,66.29
  Bottom 0.813: v101.6,56.77 v101.6,60.2 | v97.79,19.94 84.2,19.94 v73.66,30.48 60.96,43.18 60.96,67.31
  Bottom 1.016: v19.56,31.11 3.17,31.11 2.54,30.48
  Bottom 1.27: 2.54,5.08 3.81,5.08 v6.35,7.62 v8.89,7.62 | v144.4,65.91 v134.75,65.91
  Bottom 1.676: v97.79,10.58 97.79,2.54
  Bottom 2.54: v149.86,2.54 124.46,2.54 113.03,2.54 104.14,2.54 97.79,2.54 54.61,2.54 30.48,2.54 5.08,2.54 2.54,5.08 2.54,30.48 v2.54,41.4 v2.54,58.42

## Text on the board
tPlace: ETH1 | ETH2 | ETH3 | ETH0 | EcoCar | 2016-2017 | GND | E-P-206-R2.0.0 | VCC
tValues: PC21 | PC22 | PC23 | PC24 | PC31 | PC22 | PC22 | PC22 | PC22 | PC22